# Altium schematic sheet 03 - POWER SUPLY.SchDoc
size A4; Date: 20/01/2025; SheetNumber: 3; SheetTotal: 5; Nome da Sheet: 03 - POWER SUPLY; Data: 20/01/2025; Revisão: RV01B
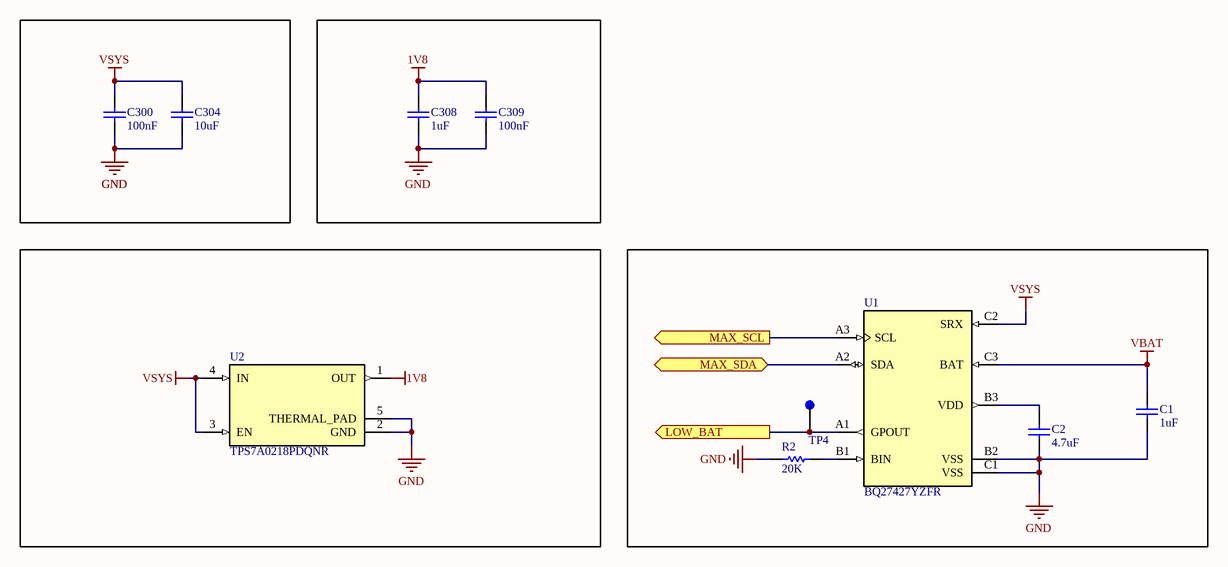
[diagram p0: 03 - POWER SUPLY.SchDoc]

## Parts
C1  value 1uF  [0402-C-R]  (hidden comment: GRM155R61E105KA12D)
C2  value 4.7uF  [0402-C-R]  (hidden comment: GRM155R61A475MEAAD)
C300  value 100nF  [0402-C-R]  (hidden comment: C0402C104K8RACTU)
C304  value 10uF  [0603-C-R]  (hidden comment: CAP SMD 0603 10uF 10V ±10%)
C308  value 1uF  [0402-C-R]  (hidden comment: GRM155R61E105KA12D)
C309  value 100nF  [0402-C-R]  (hidden comment: C0402C104K8RACTU)
R2  value 20K  [0402-R-R]  (hidden comment: RMCF0402FT20K0)
TP4  TEST POINT SMD  [TP SMD]  (value not drawn)
U1  PN: BQ27427YZFR  [IC_BQ27427YZFR]  (hidden comment: IC SINGLE-CELL BATTERY FUEL GAUGE W)
U2  PN: TPS7A0218PDQNR  [IC_TPS7A0218PDQNR]  (hidden comment: IC REG LINEAR 1.8V 200MA 4-X2SON)

## Ports
LOW_BAT (out), MAX_SCL (out), MAX_SDA (bidir)

## Nets
1V8: C308.2 C309.2 U2.1(OUT)
GND: C1.1 C2.1 C300.1 C304.1 C308.1 C309.1 R2.1 U1.B2(VSS) U1.C1(VSS) U2.2(GND) U2.5(THERMAL_PAD)
VBAT: C1.2 U1.C3(BAT)
VSYS: C300.2 C304.2 U1.C2(SRX) U2.3(EN) U2.4(IN)
LOW_BAT: TP4.1(TP) U1.A1(GPOUT) ; port LOW_BAT
MAX_SCL: U1.A3(SCL) ; port MAX_SCL
MAX_SDA: U1.A2(SDA) ; port MAX_SDA
NetC2_2: C2.2 U1.B3(VDD)
NetR2_2: R2.2 U1.B1(BIN)

## Notes on the sheet
- LESC - Laboratório de Engenharia e Sistemas de Computação
- Nome da Sheet:
- Data:
- Projetista:
- PCB Design:
- Campus do Pici - Bloco 723, S/N - Pici, Fortaleza - CE, 60455-970
- Julio Vitorino
- Revision:
- Size:
- A4

## Library data of the parts
C1 C308 = CAP SMD 0402 1uF 25V ±10%: CAP SMD 0402 MLCC GERAL 1uF 25V ±10% 0402 X5R PN:GRM155R61E105KA12D MURATA; SIZE: 0402; VOLTAGE: 25V; TOLERANCE: 10%; PN: GRM155R61E105KA12D
C2 = CAP SMD 0402 4.7uF 10V ±20%: CAP SMD 0402 MLCC GERAL 4.7uF 10V ±20% 0402 X5R PN:GRM155R61A475MEAAD MURATA; SIZE: 0402; VOLTAGE: 10V; TOLERANCE: 20%; PN: GRM155R61A475MEAAD
C300 C309 = CAP SMD 0402 100nF 10V ±20%: CAP SMD 0402 MLCC GERAL 100nF 10V ±20% 0402 X7R PN:C0402C104K8RACTU KEMET; SIZE: 0402; VOLTAGE: 10V; TOLERANCE: 20%; PN: C0402C104K8RACTU
C304 = CAP SMD 0603 10uF 10V ±10%: CAP SMD 0603 MLCC GERAL 10uF 10V ±10% X7R PN: GRM188Z71A106KA73D; SIZE: 0603; PN: GRM188Z71A106KA73D; VOLTAGE: 10V; TOLERANCE: 10%
R2 = RES SMD 0402 20K 0.063W ±1%: RES SMD GERAL FILM 20K 0.063W ±1% 0402 7" TAPE PN: RMCF0402FT20K0 STACKPOLE; PACK: 0402; POWER: 0.063W; TOLERANCE: 1%; PN: RMCF0402FT20K0
U1 = IC SINGLE-CELL BATTERY FUEL GAUGE W: Battery Fuel Gauge IC Lithium Ion 9-DSBGA PN: BQ27427YZFR; MF: Texas Instruments; Availability: In Stock; Package: None; Value: *; Purchase-URL: https://pricing.snapeda.com/search/part/BQ27427YZFR/?ref=eda; SnapEDA_Link: https://www.snapeda.com/parts/BQ27427YZFR/Texas+Instruments/view-part/?ref=snap; Price: None; Check_prices: https://www.snapeda.com/parts/BQ27427YZFR/Texas+Instruments/view-part/?ref=eda
U2 = IC REG LINEAR 1.8V 200MA 4-X2SON: Linear Voltage Regulator IC Positive Fixed 1 Output 200mA 4-X2SON (1x1) PN: TPS7A0218PDQNR; MF: {'manufacturer': u'Texas Instruments'}; Package: None; Price: None; Value: *; Availability: Unavailable